# Altium schematic sheet WCH_TOUCH_Kit_EX002.SchDoc
size A4
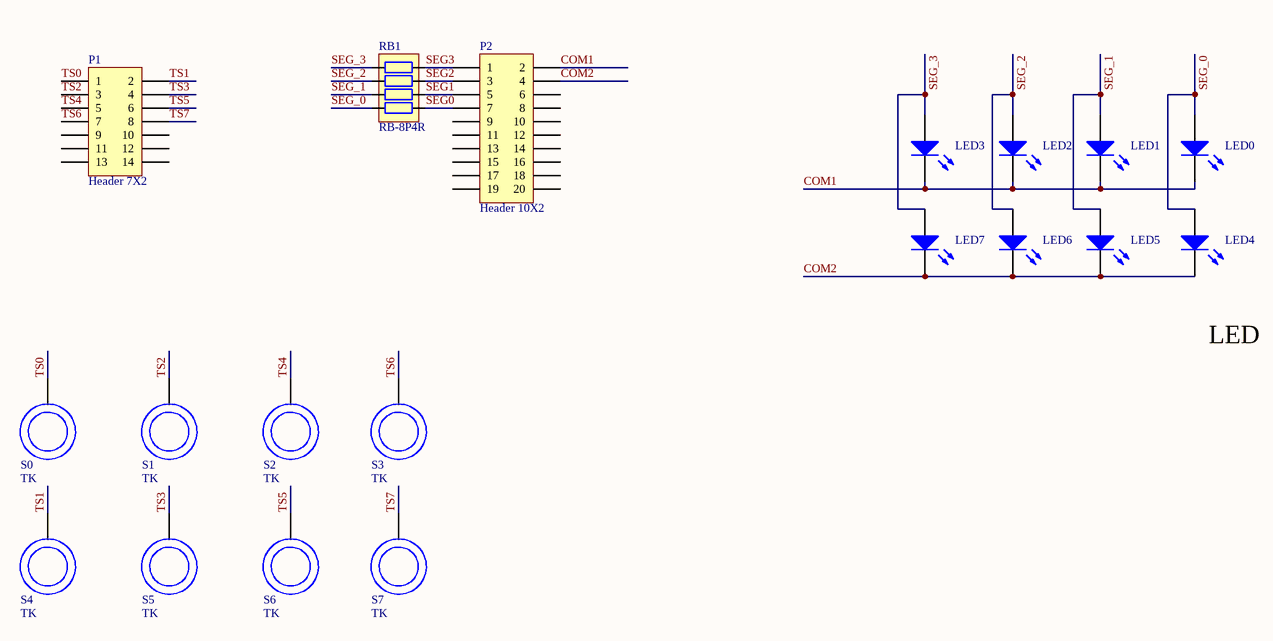
[diagram p0: WCH_TOUCH_Kit_EX002.SchDoc]

## Parts
LED0  (no value)  [LED0805-RD_EH]
LED1  (no value)  [LED0805-RD_EH]
LED2  (no value)  [LED0805-RD_EH]
LED3  (no value)  [LED0805-RD_EH]
LED4  (no value)  [LED0805-RD_EH]
LED5  (no value)  [LED0805-RD_EH]
LED6  (no value)  [LED0805-RD_EH]
LED7  (no value)  [LED0805-RD_EH]
P1  Header 7X2  [HDR-TH_14P-P2.54-H-F-R2-C10-W8.5]
P2  Header 10X2  [HDR-TH_20P-P2.54-H-F-R2-C10-W8.5]
RB1  RB-8P4R  [RCA-8P4R-0603]
S0  TK  [TOUCHKEY-12mm-S]
S1  TK  [TOUCHKEY-12mm-S]
S2  TK  [TOUCHKEY-12mm-S]
S3  TK  [TOUCHKEY-12mm-S]
S4  TK  [TOUCHKEY-12mm-S]
S5  TK  [TOUCHKEY-12mm-S]
S6  TK  [TOUCHKEY-12mm-S]
S7  TK  [TOUCHKEY-12mm-S]

## Nets
COM1: LED0.2(K) LED1.2(K) LED2.2(K) LED3.2(K) P2.2
COM2: LED4.2(K) LED5.2(K) LED6.2(K) LED7.2(K) P2.4
SEG0: P2.7 RB1.4
SEG1: P2.5 RB1.3
SEG2: P2.3 RB1.2
SEG3: P2.1 RB1.1
SEG_0: LED0.1(A) LED4.1(A) RB1.5
SEG_1: LED1.1(A) LED5.1(A) RB1.6
SEG_2: LED2.1(A) LED6.1(A) RB1.7
SEG_3: LED3.1(A) LED7.1(A) RB1.8
TS0: P1.1 S0.1
TS1: P1.2 S4.1
TS2: P1.3 S1.1
TS3: P1.4 S5.1
TS4: P1.5 S2.1
TS5: P1.6 S6.1
TS6: P1.7 S3.1
TS7: P1.8 S7.1

Not connected (* = marked no-connect by the designer): P1 9 10 11 12 13 14; P2 6 8 9 10 11 12 13 14 15 16 17 18 19 20

## Notes on the sheet
- LED

## Library data of the parts
LED0-LED7 = LED3: Typical BLUE SiC LED; Published: 8-Jun-2000; LatestRevisionDate: 17-Dec-2003; LatestRevisionNote: PCB Footprint replaced.; DatasheetVersion: 16-Apr-2002; PackageVersion: 16-Apr-2002; PackageReference: 3.5X2.8X1.9; Publisher: Altium Limited; PackageDescription: SM LED; 2 C-Bend Leads; Body 3.5 x 2.8 x 1.9 mm, inc leads (LxWxH typ)
P1 = Header 7X2: Header, 7-Pin, Dual row; LatestRevisionDate: 17-Jul-2002; LatestRevisionNote: Re-released for DXP Platform.; Publisher: Altium Limited
P2 = Header 10X2: Header, 10-Pin, Dual row; LatestRevisionDate: 17-Jul-2002; LatestRevisionNote: Re-released for DXP Platform.; Publisher: Altium Limited
RB1 = RB-8P4R: 贴片网络排阻